# Altium schematic sheet Sheet3.SchDoc
size A4
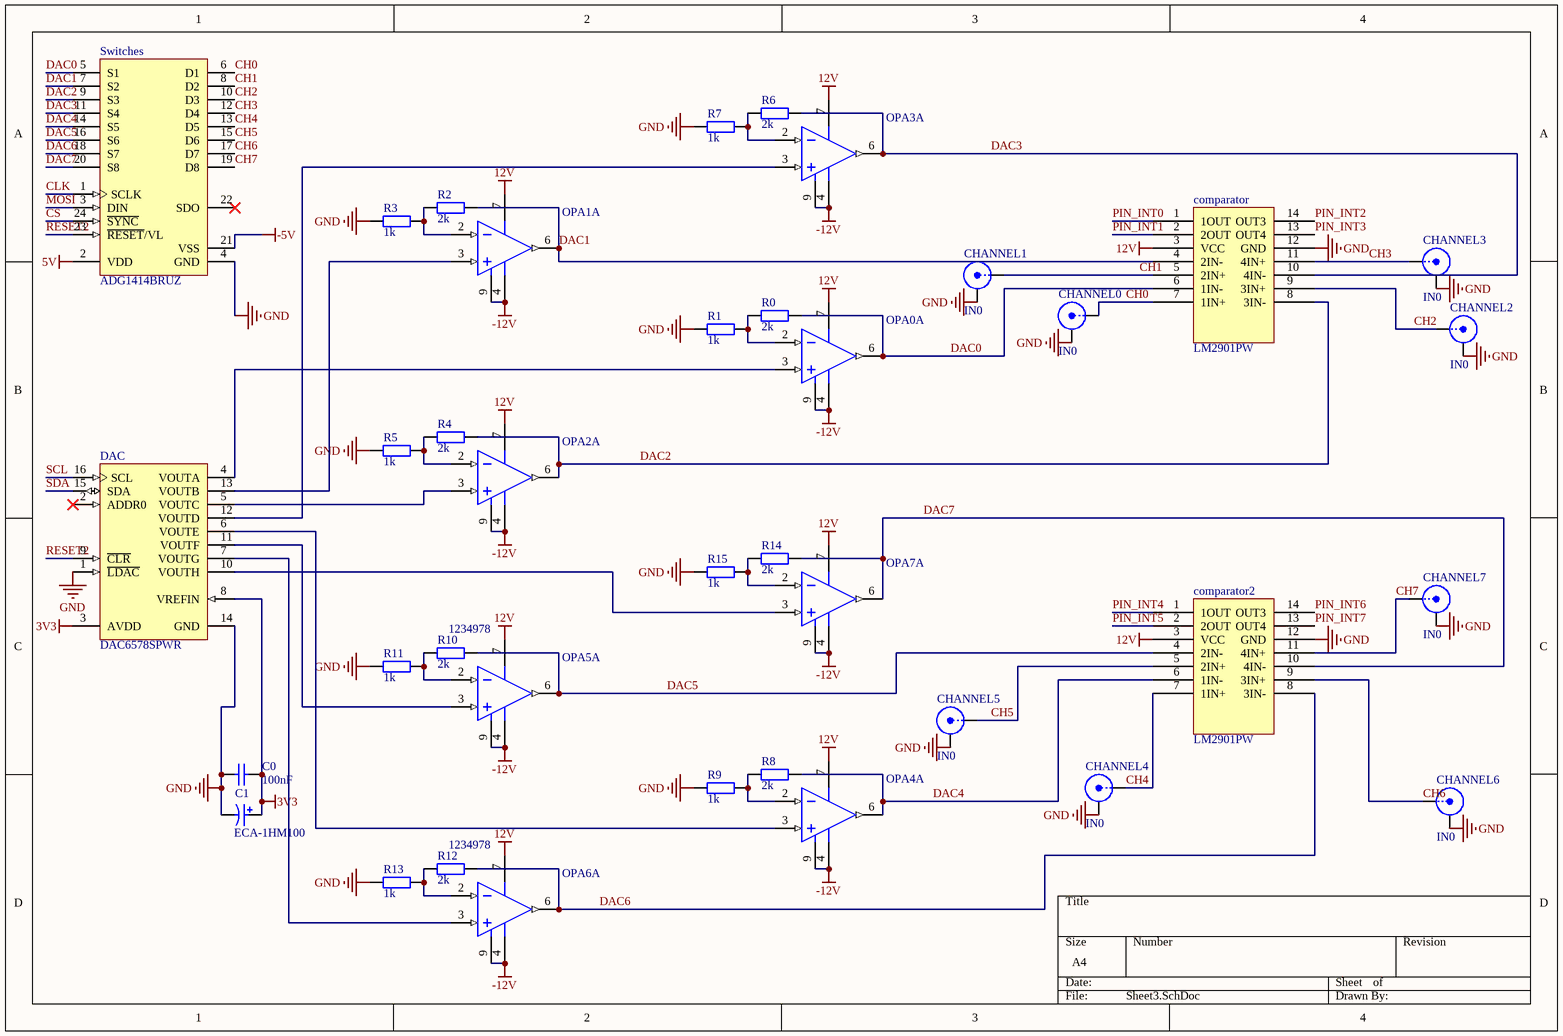
[diagram p0: Sheet3.SchDoc]

## Parts
C0  100nF  [C0805]
C1  ECA-1HM100  [CAPPR55-200-1100X500X1200]
CHANNEL0  IN0  [SMB]
CHANNEL1  IN0  [SMB]
CHANNEL2  IN0  [SMB]
CHANNEL3  IN0  [SMB]
CHANNEL4  IN0  [SMB]
CHANNEL5  IN0  [SMB]
CHANNEL6  IN0  [SMB]
CHANNEL7  IN0  [SMB]
comparator  LM2901PW  [TSSOP-14]
comparator2  LM2901PW  [TSSOP-14]
DAC  DAC6578SPWR  [TI-PW16_N]
OPA0  THS3001IDGNG4  [TI-DGN8-1760X1425TP_N]  (value not drawn)  (part A of 2)
OPA1  THS3001IDGNG4  [TI-DGN8-1760X1425TP_N]  (value not drawn)  (part A of 2)
OPA2  THS3001IDGNG4  [TI-DGN8-1760X1425TP_N]  (value not drawn)  (part A of 2)
OPA3  THS3001IDGNG4  [TI-DGN8-1760X1425TP_N]  (value not drawn)  (part A of 2)
OPA4  THS3001IDGNG4  [TI-DGN8-1760X1425TP_N]  (value not drawn)  (part A of 2)
OPA5  Supplier Part Number 1: 1234978  [TI-DGN8-1760X1425TP_N]  (hidden comment: THS3001IDGNG4)  (part A of 2)
OPA6  Supplier Part Number 1: 1234978  [TI-DGN8-1760X1425TP_N]  (hidden comment: THS3001IDGNG4)  (part A of 2)
OPA7  THS3001IDGNG4  [TI-DGN8-1760X1425TP_N]  (value not drawn)  (part A of 2)
R0  value 2k  [6-0805_N]  (hidden comment: 1k-0W25-0805)
R1  value 1k  [6-0805_N]  (hidden comment: 1k-0W25-0805)
R2  value 2k  [6-0805_N]  (hidden comment: 1k-0W25-0805)
R3  value 1k  [6-0805_N]  (hidden comment: 1k-0W25-0805)
R4  value 2k  [6-0805_N]  (hidden comment: 1k-0W25-0805)
R5  value 1k  [6-0805_N]  (hidden comment: 1k-0W25-0805)
R6  value 2k  [6-0805_N]  (hidden comment: 1k-0W25-0805)
R7  value 1k  [6-0805_N]  (hidden comment: 1k-0W25-0805)
R8  value 2k  [6-0805_N]  (hidden comment: 1k-0W25-0805)
R9  value 1k  [6-0805_N]  (hidden comment: 1k-0W25-0805)
R10  value 2k  [6-0805_N]  (hidden comment: 1k-0W25-0805)
R11  value 1k  [6-0805_N]  (hidden comment: 1k-0W25-0805)
R12  value 2k  [6-0805_N]  (hidden comment: 1k-0W25-0805)
R13  value 1k  [6-0805_N]  (hidden comment: 1k-0W25-0805)
R14  value 2k  [6-0805_N]  (hidden comment: 1k-0W25-0805)
R15  value 1k  [6-0805_N]  (hidden comment: 1k-0W25-0805)
Switches  ADG1414BRUZ  [ADI-RU-24_N]

## Nets
3V3: C0.2 C1.1 DAC.3(AVDD) DAC.8(VREFIN)
5V: Switches.2(VDD)
12V: comparator.3(VCC) comparator2.3(VCC) OPA0.7(VCC+) OPA1.7(VCC+) OPA2.7(VCC+) OPA3.7(VCC+) OPA4.7(VCC+) OPA5.7(VCC+) OPA6.7(VCC+) OPA7.7(VCC+)
-5V: Switches.21(VSS)
-12V: OPA0.4(VCC-) OPA0.9(EP) OPA1.4(VCC-) OPA1.9(EP) OPA2.4(VCC-) OPA2.9(EP) OPA3.4(VCC-) OPA3.9(EP) OPA4.4(VCC-) OPA4.9(EP) OPA5.4(VCC-) OPA5.9(EP) OPA6.4(VCC-) OPA6.9(EP) OPA7.4(VCC-) OPA7.9(EP)
GND: C0.1 C1.2 CHANNEL0.2(Y) CHANNEL1.2(Y) CHANNEL2.2(Y) CHANNEL3.2(Y) CHANNEL4.2(Y) CHANNEL5.2(Y) CHANNEL6.2(Y) CHANNEL7.2(Y) comparator.12(GND) comparator2.12(GND) DAC.1(~{LDAC}) DAC.14(GND) R1.1 R3.1 R5.1 R7.1 R9.1 R11.1 R13.1 R15.1 Switches.4(GND)
CH0: CHANNEL0.1(X) comparator.7(1IN+) Switches.6(D1)
CH1: CHANNEL1.1(X) comparator.5(2IN+) Switches.8(D2)
CH2: CHANNEL2.1(X) comparator.9(3IN+) Switches.10(D3)
CH3: CHANNEL3.1(X) comparator.11(4IN+) Switches.12(D4)
CH4: CHANNEL4.1(X) comparator2.7(1IN+) Switches.13(D5)
CH5: CHANNEL5.1(X) comparator2.5(2IN+) Switches.15(D6)
CH6: CHANNEL6.1(X) comparator2.9(3IN+) Switches.17(D7)
CH7: CHANNEL7.1(X) comparator2.11(4IN+) Switches.19(D8)
CLK: Switches.1(SCLK)
CS: Switches.24(~{SYNC})
DAC0: comparator.6(1IN-) OPA0.6(OUT) R0.2 Switches.5(S1)
DAC1: comparator.4(2IN-) OPA1.6(OUT) R2.2 Switches.7(S2)
DAC2: comparator.8(3IN-) OPA2.6(OUT) R4.2 Switches.9(S3)
DAC3: comparator.10(4IN-) OPA3.6(OUT) R6.2 Switches.11(S4)
DAC4: comparator2.6(1IN-) OPA4.6(OUT) R8.2 Switches.14(S5)
DAC5: comparator2.4(2IN-) OPA5.6(OUT) R10.2 Switches.16(S6)
DAC6: comparator2.8(3IN-) OPA6.6(OUT) R12.2 Switches.18(S7)
DAC7: comparator2.10(4IN-) OPA7.6(OUT) R14.2 Switches.20(S8)
MOSI: Switches.3(DIN)
PIN_INT0: comparator.1(1OUT)
PIN_INT1: comparator.2(2OUT)
PIN_INT2: comparator.14(OUT3)
PIN_INT3: comparator.13(OUT4)
PIN_INT4: comparator2.1(1OUT)
PIN_INT5: comparator2.2(2OUT)
PIN_INT6: comparator2.14(OUT3)
PIN_INT7: comparator2.13(OUT4)
RESET2: DAC.9(~{CLR}) Switches.23(~{RESET}/VL)
SCL: DAC.16(SCL)
SDA: DAC.15(SDA)
NetDAC_4: DAC.4(VOUTA) OPA0.3(IN+)
NetDAC_5: DAC.5(VOUTC) OPA2.3(IN+)
NetDAC_6: DAC.6(VOUTE) OPA4.3(IN+)
NetDAC_7: DAC.7(VOUTG) OPA6.3(IN+)
NetDAC_10: DAC.10(VOUTH) OPA7.3(IN+)
NetDAC_11: DAC.11(VOUTF) OPA5.3(IN+)
NetDAC_12: DAC.12(VOUTD) OPA3.3(IN+)
NetDAC_13: DAC.13(VOUTB) OPA1.3(IN+)
NetOPA0_2: OPA0.2(IN-) R0.1 R1.2
NetOPA1_2: OPA1.2(IN-) R2.1 R3.2
NetOPA2_2: OPA2.2(IN-) R4.1 R5.2
NetOPA3_2: OPA3.2(IN-) R6.1 R7.2
NetOPA4_2: OPA4.2(IN-) R8.1 R9.2
NetOPA5_2: OPA5.2(IN-) R10.1 R11.2
NetOPA6_2: OPA6.2(IN-) R12.1 R13.2
NetOPA7_2: OPA7.2(IN-) R14.1 R15.2

Not connected (* = marked no-connect by the designer): DAC 2(ADDR0)*; Switches 22(SDO)*

## Library data of the parts
C0 = Ceramic 100nF/50V: Capacitor Cer 50V 0805 Vishay X7R; PackageReference: 0805; Supplier 1: Farnell; Supplier Part Number 1: 1612208; Value: 100nF
C1 = CMP-1665-00038-1: Aluminum Electrolytic Capacitor, 10 uF, +/- 20%, 50 V, -40 to 85 degC, 2-Pin THD, RoHS, Bulk; Max Power Dissipation: 625 mW; Min Supply Voltage: 4.5 V; Max Ouput Current: 200 mA; Nominal Supply Current: 10 mA; Case\Package: SOIC; Max Supply Voltage: 16 V; Max Operating Temperature: 70 degC; DatasheetVersion: Mar-16; ComponentLink1URL: http://www.panasonic.com/; Packaging: Tape and Reel; PackageDescription: 2-Pin Radial Lead, Dia 5 mm, Body Length 11 mm; ComponentLink2Description: Datasheet; Mount: Surface Mount; Width: 4 mm; RoHSCompliant: true; Length: 5 mm; Pins: 8; PackageReference: CAPPR55-200-1100X500X1200; ComponentLink1Description: Manufacturer URL; Package Quantity: 2500; ComponentLink2URL: http://industrial.panasonic.com/cdbs/www-data/pdf/RDF0000/DMF0000COL68.pdf; Height: 1.5 mm; Radiation Hardening: No; Min Operating Temperature: 0 degC
CHANNEL0-CHANNEL7 = SMB: SMB Straight Connector; LatestRevisionDate: 17-Jul-2002; LatestRevisionNote: Re-released for DXP Platform.; Publisher: Altium Limited; Supplier 1: Farnell; Supplier Part Number 1: 1206013
DAC = CMP-0004-01130-1: 10-Bit, Octal Channel, Ultra-Low Glitch, Voltage Output, 2-Wire Interface DAC, -40 to 125 degC, 16-pin SOP (PW16), Green (RoHS & no Sb/Br); Manufacturer: Texas Instruments; DAC Channels: 8; INL(Max)(+/-LSB): 0.5; Power Consumption(Typ)(mW): 3.67; Resolution(Bits): 10; SubFamily: Precision DAC (=<10MSPS); Settling Time(us): 7; Interface: Serial I2C; DatasheetVersion: SBAS496A; ComponentLink3Description: Package Specification; Mounting Technology: Surface Mount; ComponentLink1URL: http://www.ti.com/; ComponentLink2Description: Datasheet; Code_JEDEC: MO-153; ComponentLink2URL: http://www.ti.com/general/docs/lit/getliterature.tsp?genericPartNumber=DAC6578&fileType=pdf; ComponentLink3URL: http://www.ti.com/lit/ml/mpds361/mpds361.pdf; DNL(Max)(+/-LSB): 0.5; PackageReference: PW16; PackageVersion: 4040064-4/G, 02/2011; PackageDescription: 16-Pin Plastic Small Outline, Body 5 x 4.4 mm, Pitch 0.65 mm; Eco-Plan: Green (RoHS & no Sb/Br); PartNumber: DAC6578SPWR; ComponentLink1Description: Manufacturer URL; Supplier 1: Farnell; Supplier Part Number 1: 1854519
OPA0-OPA7 = CMP-0016-00120-1: 420 MHz Current-Feedback Amplifier, 9 to 32 V, -40 to 85 degC, 8-pin SOP (DGN8), Green (RoHS & no Sb/Br); Manufacturer: Texas Instruments; Diff Gain(%): 0.01; Iq per channel(Max)(mA): 10; Vs(Min)(V): 9; Acl, min stable gain(V/V): 1; BW @ Acl(MHz): 420; @ MHz: 5; 2nd Harmonic(dBc): 91; Vio(Max)(mV): 3; 3rd Harmonic(dBc): 86; Vn at Flatband(Typ)(nV/rtHz): 1.6; Slew Rate(Typ)(V/us): 6500; THD (Fc is 1 MHz)(Typ)(dB): -96; Iib(Max)(nA): 15000; Sub Family: High Output Current Amplifier (>=50mA), High Speed Amplifier (>=50MHz), High Supply Voltage Amplifier (>=30V); Vs(Max)(V): 32; Diff Phase(deg): 0.02; Settling Time (0.1%)(Typ)(ns): 40; Io(Typ)(mA): 120; PackageDescription: 8-pin Plastic Small Outline, Body 3 x 3 mm, Pitch 0.65 mm; Eco-Plan: Green (RoHS & no Sb/Br); ComponentLink3Description: Package Specification; ComponentLink3URL: http://www.ti.com/litv/pdf/mpds046e; Mounting Technology: Surface Mount; ComponentLink2URL: http://www.ti.com/general/docs/lit/getliterature.tsp?genericPartNumber=THS3001&fileType=pdf; ComponentLink1Description: Manufacturer URL; PartNumber: THS3001IDGNG4; PackageReference: DGN8-1760X1425TP; Code_JEDEC: MO-187; ComponentLink2Description: Datasheet; Number of Channels: 1; PackageVersion: 4073271/F, 05/2011; ComponentLink1URL: http://www.ti.com/; DatasheetVersion: SLOS217H; Supplier 1: Farnell
  OPA0-OPA4 OPA7: Supplier Part Number 1: 1234978
R0-R15 = 1k-0W25-0805: Resistor; Published: 8-Jun-2000; LatestRevisionDate: 17-Jul-2002; LatestRevisionNote: Re-released for DXP Platform.; PackageReference: AXIAL-0.4; Publisher: Altium Limited
  R0 R2 R4 R6 R8 R10 R12 R14: Supplier 1: Farnell; Supplier Part Number 1: 2057613
  R1 R3 R5 R7 R9 R11 R13 R15: Supplier Part Number 1: 1750754
Switches = CMP-0790-00247-1: 9.5 Ohm RON +/-15 V / +12 V / +/-5 V iCMOS Serially-Controlled Octal SPST Switch, -40 to 125 degC, 24-pin SOP (RU-24), Tube; Manufacturer: Analog Devices; Is OFF: 50pA, 20pA, 20pA; Id, Is (ON): 100pA, 50pA, 50pA; Ron (ohms): 9.5; Power Dissipation: 2.8mW; Configuration: SPST; ComponentLink2Description: Datasheet; PackageReference: RU-24; ComponentLink1URL: http://www.analog.com/en/index.html; ComponentLink2URL: http://www.analog.com/static/imported-files/data_sheets/ADG1414.pdf; Mounting Technology: Surface Mount; Code_JEDEC: MO-153AD; Packing: Tube; DatasheetVersion: Rev. 0; PackageDescription: 24-Pin Thin Shrink Small Outline Package, Body 7.8 x 4.4 mm, Pitch 0.65 mm; PackageVersion: Nov-02; ComponentLink3URL: http://www.analog.com/static/imported-files/packages/380523655245964505593671154107510036154RU24.pdf; ComponentLink1Description: Manufacturer URL; PartNumber: ADG1414BRUZ; ComponentLink3Description: Package Specification
comparator comparator2 = LM2901PW: Supplier 1: Farnell; Supplier Part Number 1: 2295995